# EAGLE design BackPlane (EAGLE 8.6.1)
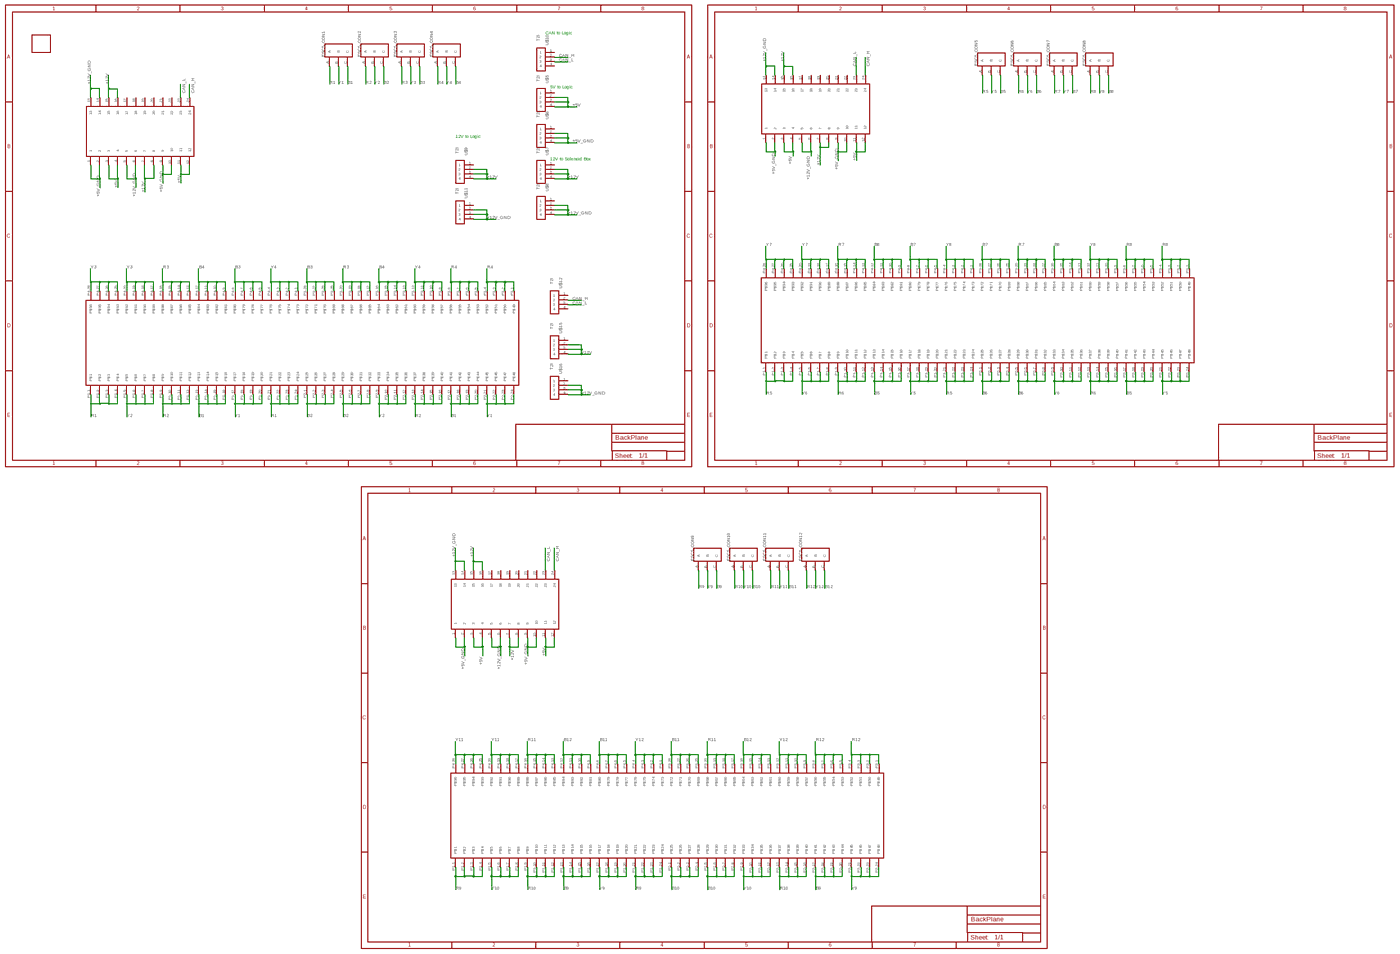
[diagram p0: schematic, sheet 1, overview]
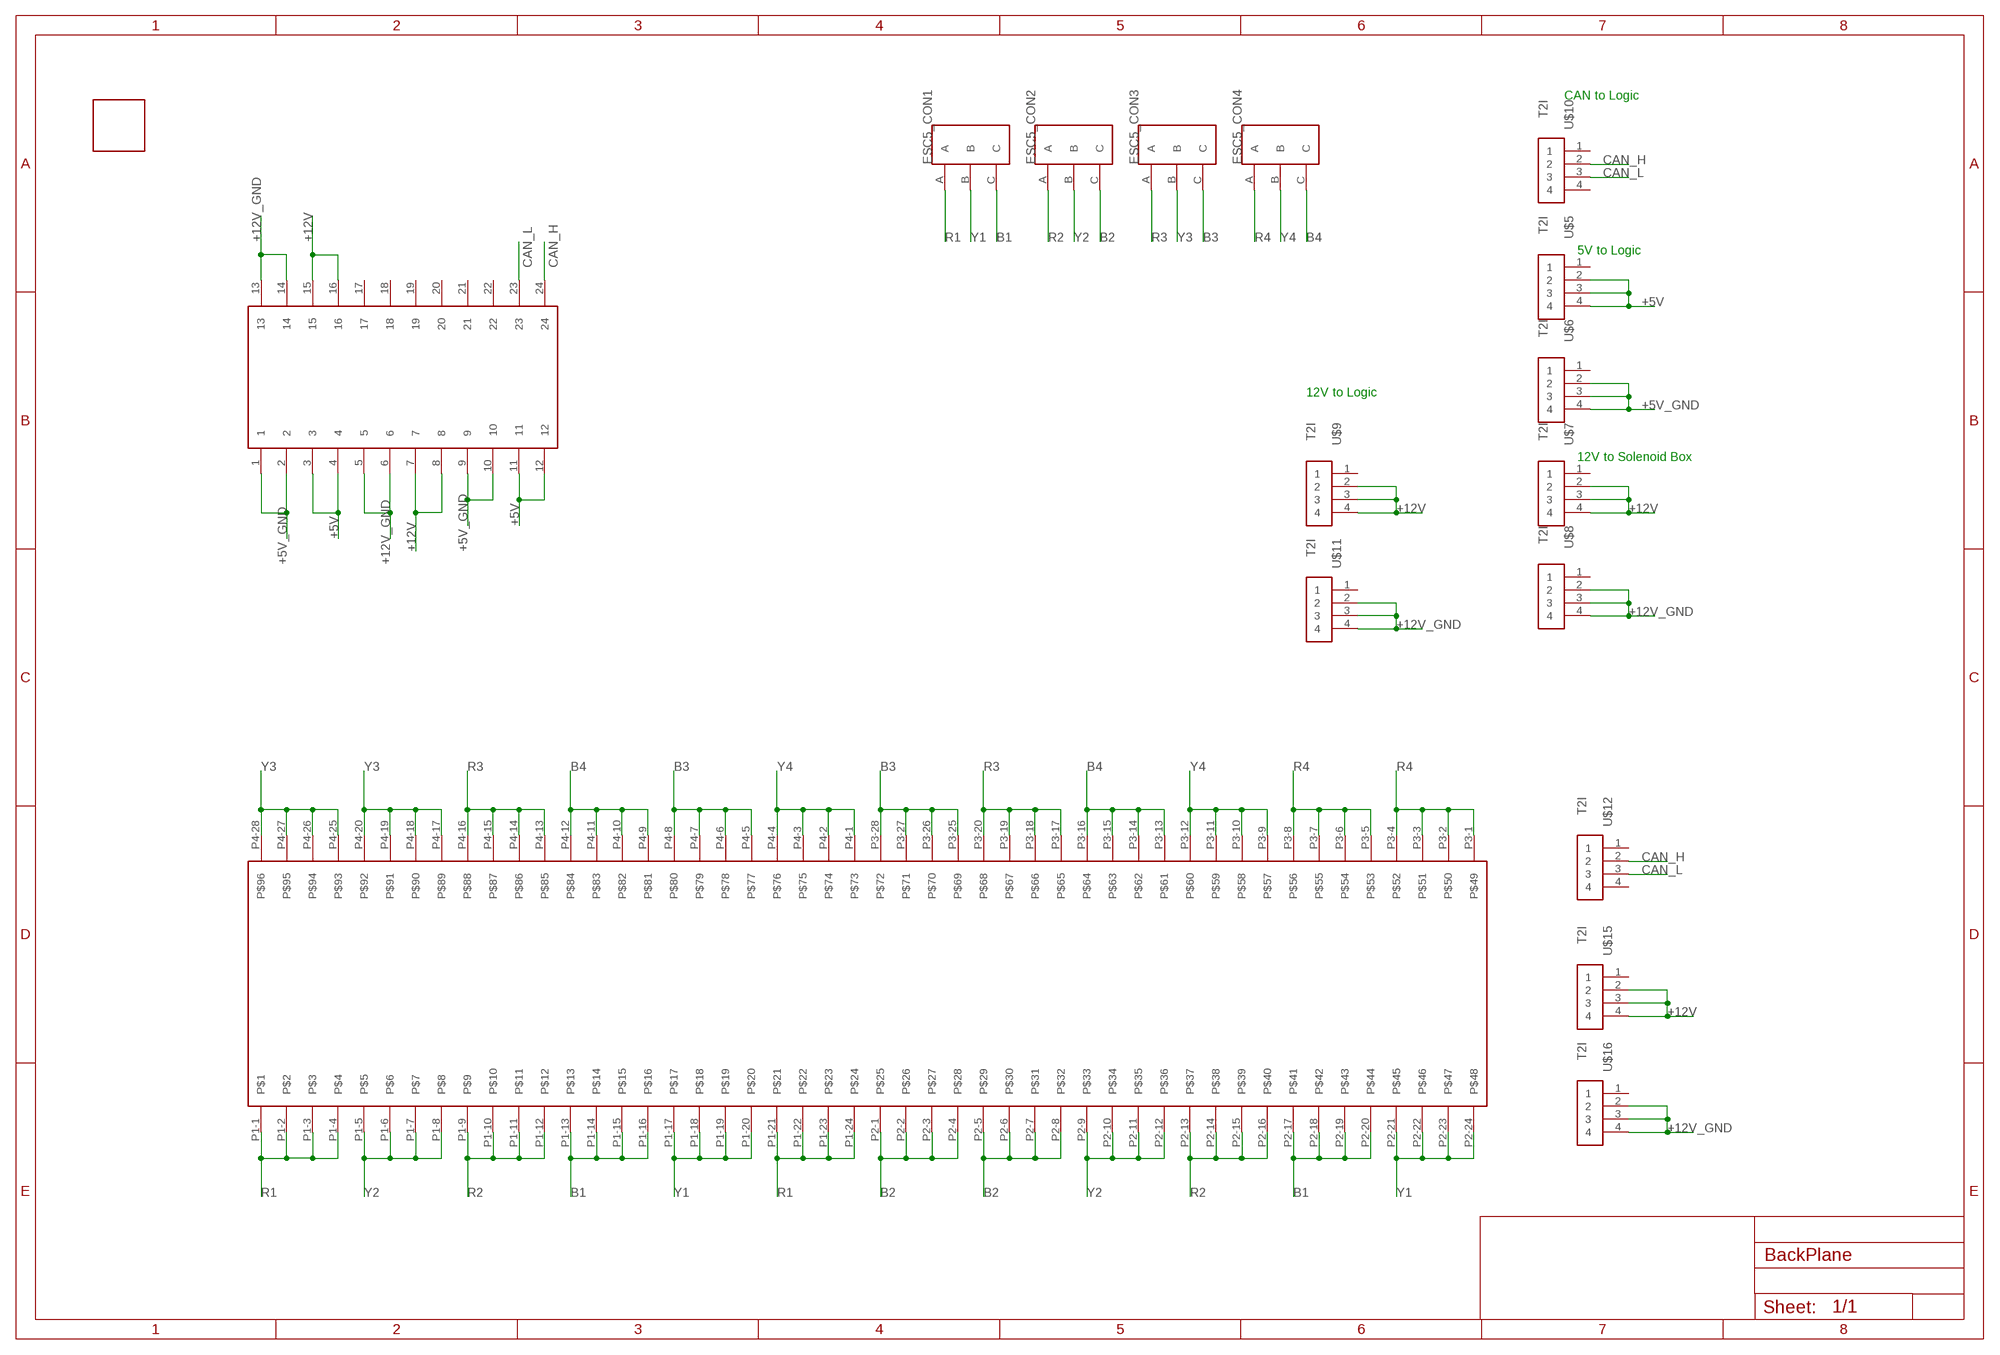
[diagram p1: schematic, sheet 1, part 1 of 4]
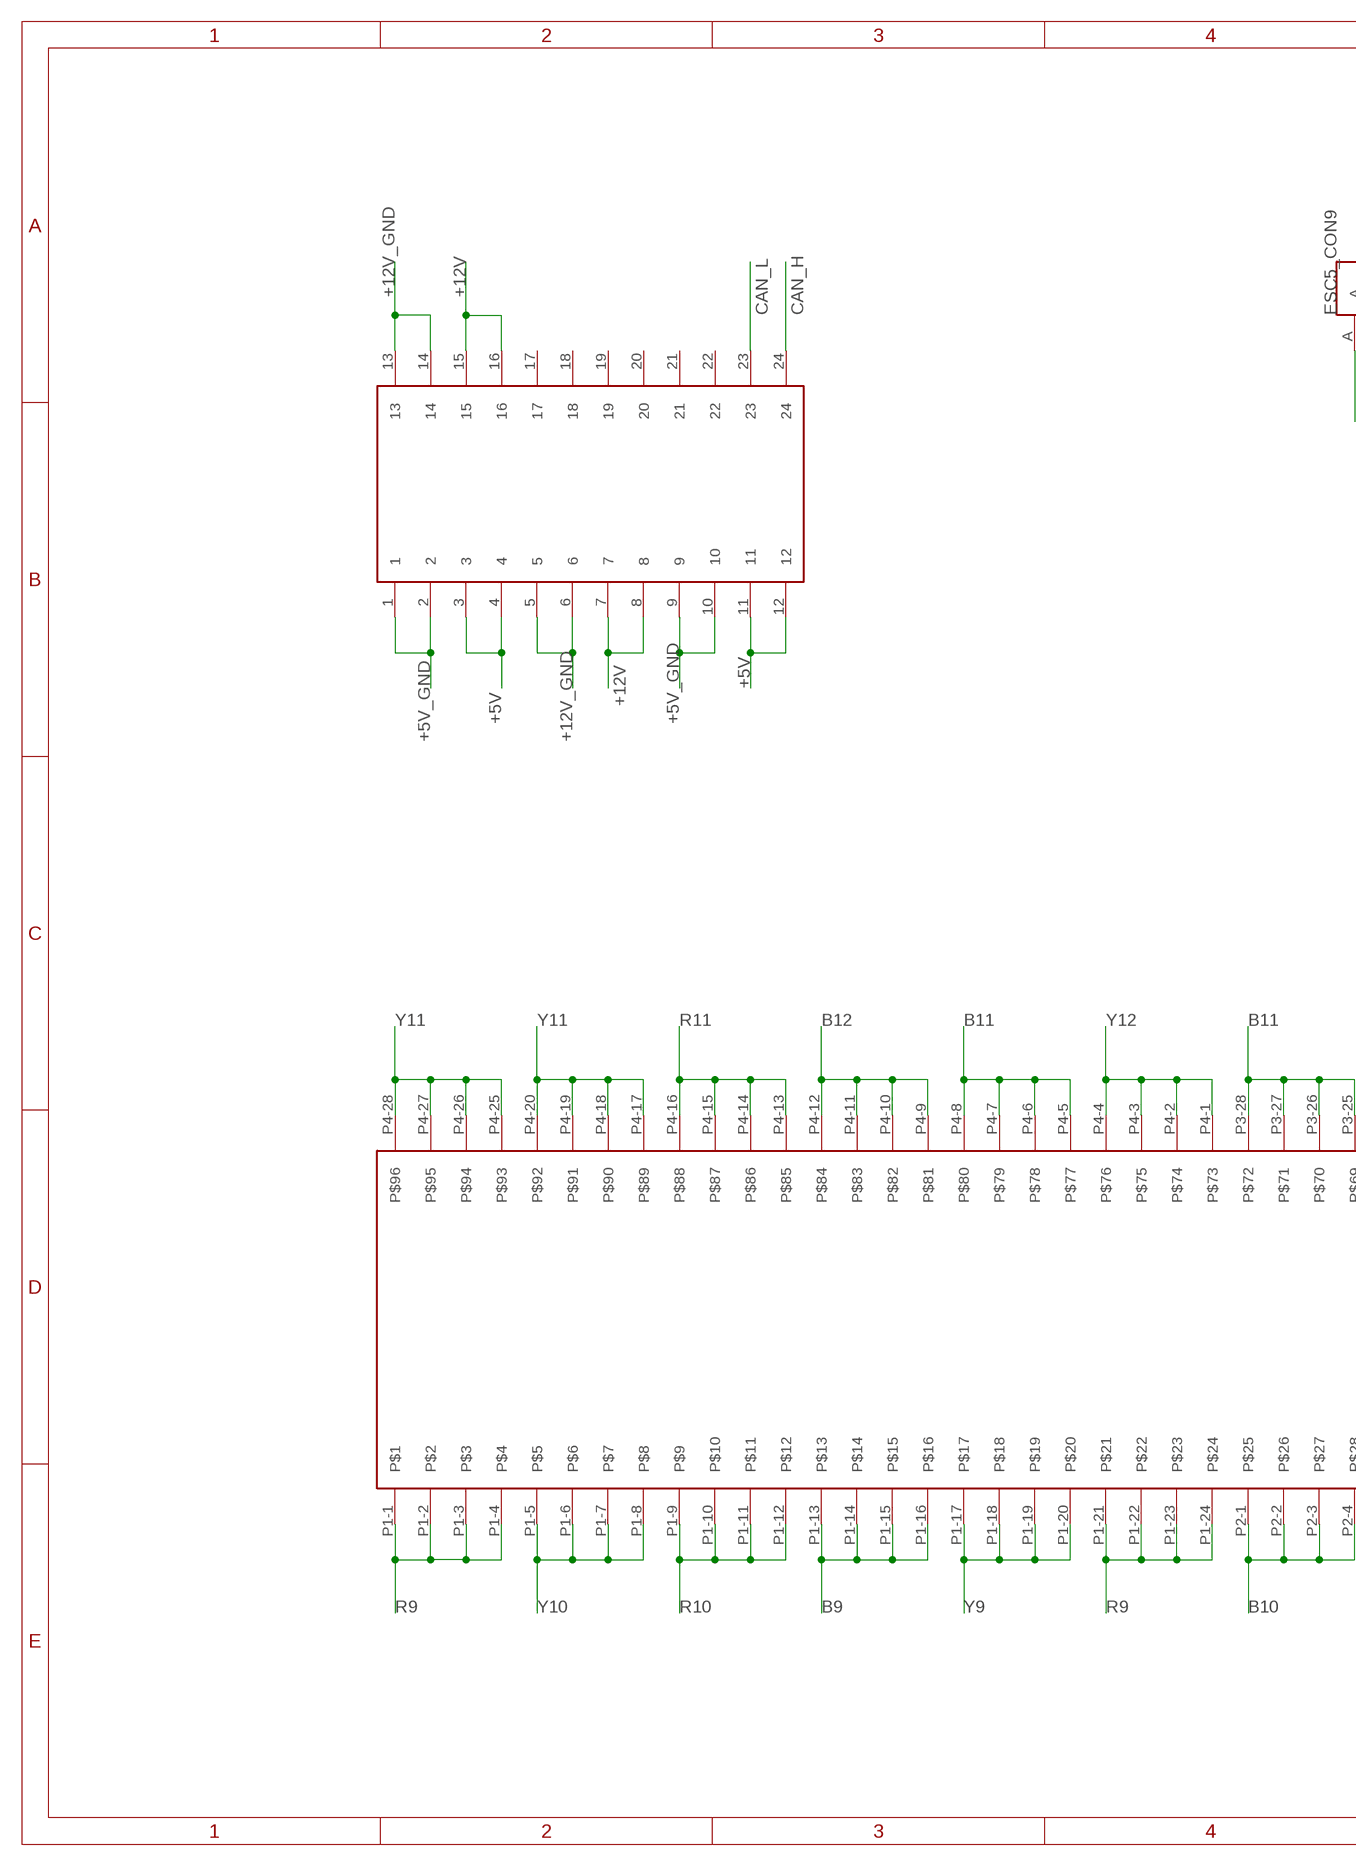
[diagram p2: schematic, sheet 1, part 2 of 4]
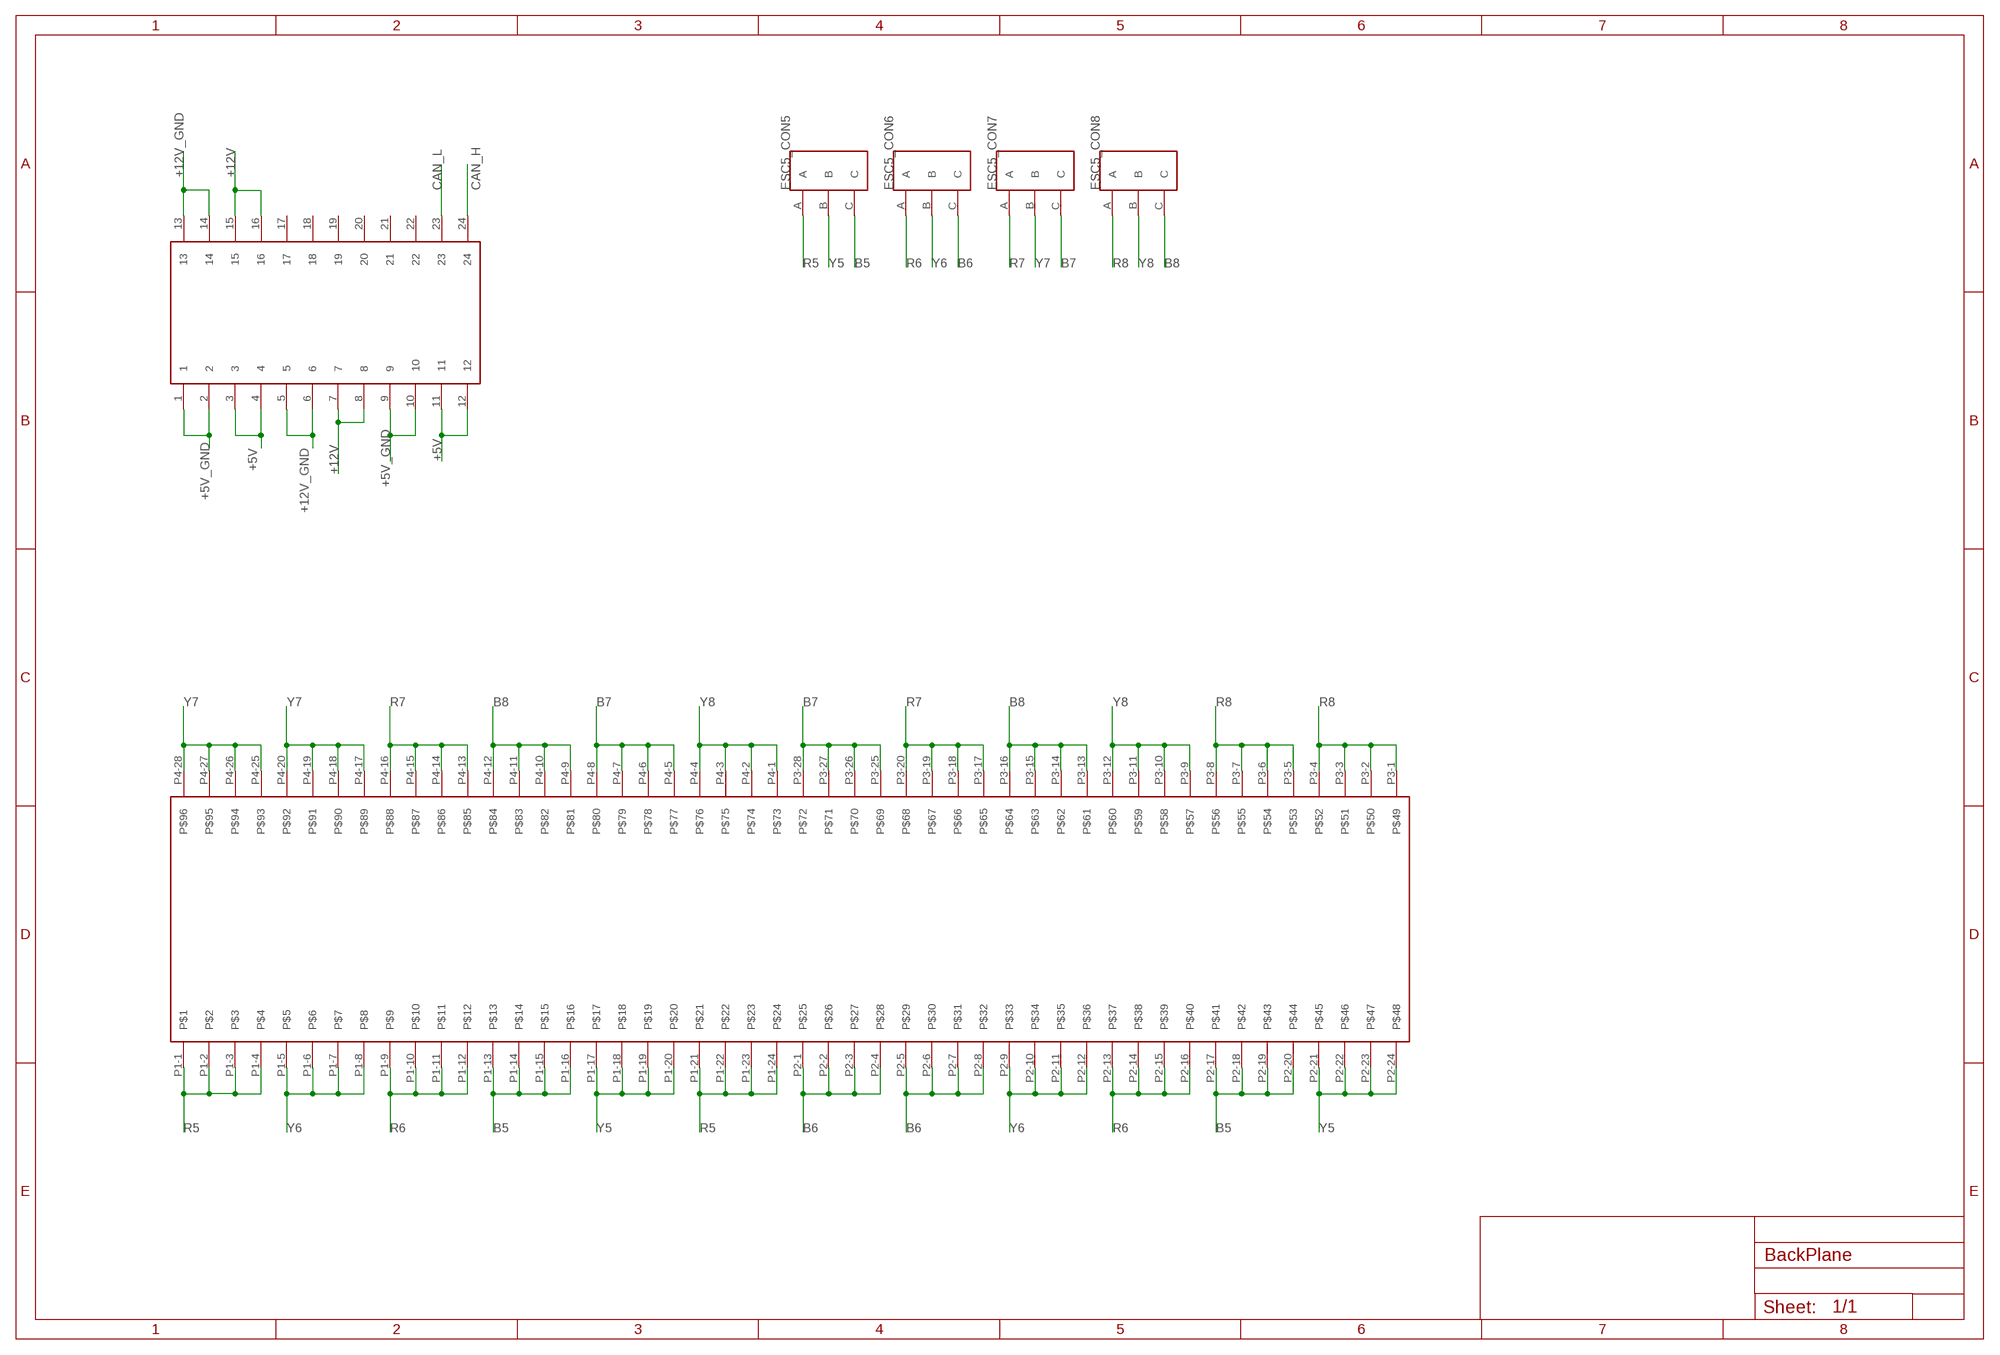
[diagram p3: schematic, sheet 1, part 3 of 4]
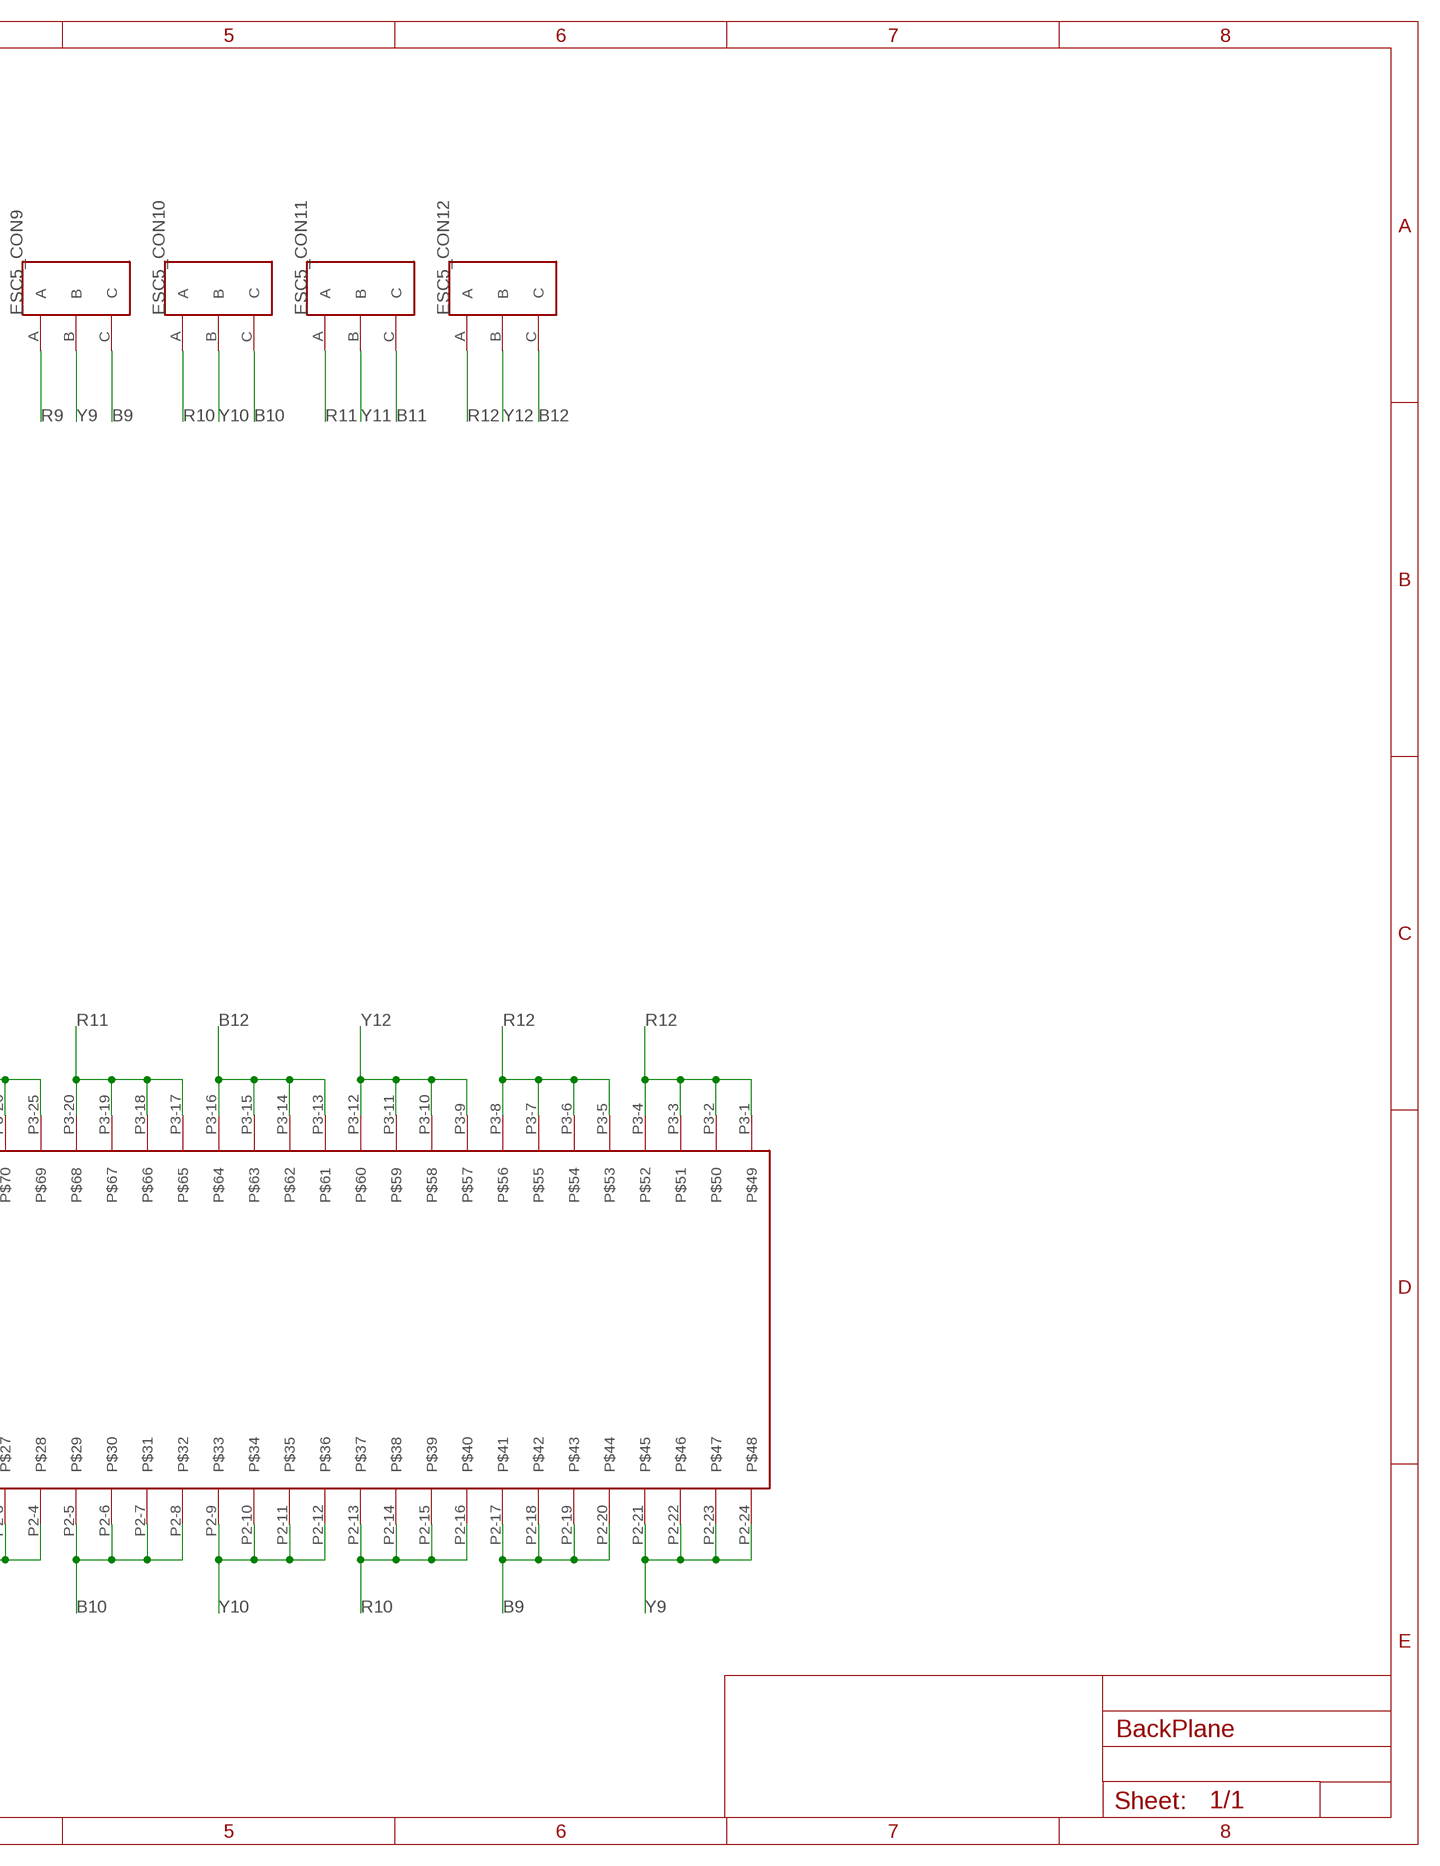
[diagram p4: schematic, sheet 1, part 4 of 4]

## Parts
ESC5_CON1  3PINCONNECTOR  [3PINCONNECTOR]
ESC5_CON2  3PINCONNECTOR  [3PINCONNECTOR]
ESC5_CON3  3PINCONNECTOR  [3PINCONNECTOR]
ESC5_CON4  3PINCONNECTOR  [3PINCONNECTOR]
ESC5_CON5  3PINCONNECTOR  [3PINCONNECTOR]
ESC5_CON6  3PINCONNECTOR  [3PINCONNECTOR]
ESC5_CON7  3PINCONNECTOR  [3PINCONNECTOR]
ESC5_CON8  3PINCONNECTOR  [3PINCONNECTOR]
ESC5_CON9  3PINCONNECTOR  [3PINCONNECTOR]
ESC5_CON10  3PINCONNECTOR  [3PINCONNECTOR]
ESC5_CON11  3PINCONNECTOR  [3PINCONNECTOR]
ESC5_CON12  3PINCONNECTOR  [3PINCONNECTOR]
U$1  BOARDBKP  [BKP]
U$2  THICC_CONNECTOR  [THICC_CONNECTOR]
U$3  THICC_CONNECTOR  [THICC_CONNECTOR]
U$4  THICC_CONNECTOR  [THICC_CONNECTOR]
U$5  T2I  [T2I]
U$6  T2I  [T2I]
U$7  T2I  [T2I]
U$8  T2I  [T2I]
U$9  T2I  [T2I]
U$10  T2I  [T2I]
U$11  T2I  [T2I]
U$12  T2I  [T2I]
U$15  T2I  [T2I]
U$16  T2I  [T2I]

## Nets
+5V: U$2.3 U$2.4 U$2.11 U$2.12 U$3.3 U$3.4 U$3.11 U$3.12 U$4.3 U$4.4 U$4.11 U$4.12 U$5.2 U$5.3 U$5.4
+5V_GND: U$2.1 U$2.2 U$2.9 U$2.10 U$3.1 U$3.2 U$3.9 U$3.10 U$4.1 U$4.2 U$4.9 U$4.10 U$6.2 U$6.3 U$6.4
+12V: U$2.7 U$2.8 U$2.15 U$2.16 U$3.7 U$3.8 U$3.15 U$3.16 U$4.7 U$4.8 U$4.15 U$4.16 U$7.2 U$7.3 U$7.4 U$9.2 U$9.3 U$9.4 U$15.2 U$15.3 U$15.4
+12V_GND: U$2.5 U$2.6 U$2.13 U$2.14 U$3.5 U$3.6 U$3.13 U$3.14 U$4.5 U$4.6 U$4.13 U$4.14 U$8.2 U$8.3 U$8.4 U$11.2 U$11.3 U$11.4 U$16.2 U$16.3 U$16.4
B1: ESC5_CON1.C U$2.P1-13 U$2.P1-14 U$2.P1-15 U$2.P1-16 U$2.P2-17 U$2.P2-18 U$2.P2-19 U$2.P2-20
B2: ESC5_CON2.C U$2.P2-1 U$2.P2-2 U$2.P2-3 U$2.P2-4 U$2.P2-5 U$2.P2-6 U$2.P2-7 U$2.P2-8
B3: ESC5_CON3.C U$2.P3-25 U$2.P3-26 U$2.P3-27 U$2.P3-28 U$2.P4-5 U$2.P4-6 U$2.P4-7 U$2.P4-8
B4: ESC5_CON4.C U$2.P3-13 U$2.P3-14 U$2.P3-15 U$2.P3-16 U$2.P4-9 U$2.P4-10 U$2.P4-11 U$2.P4-12
B5: ESC5_CON5.C U$3.P1-13 U$3.P1-14 U$3.P1-15 U$3.P1-16 U$3.P2-17 U$3.P2-18 U$3.P2-19 U$3.P2-20
B6: ESC5_CON6.C U$3.P2-1 U$3.P2-2 U$3.P2-3 U$3.P2-4 U$3.P2-5 U$3.P2-6 U$3.P2-7 U$3.P2-8
B7: ESC5_CON7.C U$3.P3-25 U$3.P3-26 U$3.P3-27 U$3.P3-28 U$3.P4-5 U$3.P4-6 U$3.P4-7 U$3.P4-8
B8: ESC5_CON8.C U$3.P3-13 U$3.P3-14 U$3.P3-15 U$3.P3-16 U$3.P4-9 U$3.P4-10 U$3.P4-11 U$3.P4-12
B9: ESC5_CON9.C U$4.P1-13 U$4.P1-14 U$4.P1-15 U$4.P1-16 U$4.P2-17 U$4.P2-18 U$4.P2-19 U$4.P2-20
B10: ESC5_CON10.C U$4.P2-1 U$4.P2-2 U$4.P2-3 U$4.P2-4 U$4.P2-5 U$4.P2-6 U$4.P2-7 U$4.P2-8
B11: ESC5_CON11.C U$4.P3-25 U$4.P3-26 U$4.P3-27 U$4.P3-28 U$4.P4-5 U$4.P4-6 U$4.P4-7 U$4.P4-8
B12: ESC5_CON12.C U$4.P3-13 U$4.P3-14 U$4.P3-15 U$4.P3-16 U$4.P4-9 U$4.P4-10 U$4.P4-11 U$4.P4-12
CAN_H: U$2.24 U$3.24 U$4.24 U$10.2 U$12.2
CAN_L: U$2.23 U$3.23 U$4.23 U$10.3 U$12.3
R1: ESC5_CON1.A U$2.P1-1 U$2.P1-2 U$2.P1-3 U$2.P1-4 U$2.P1-21 U$2.P1-22 U$2.P1-23 U$2.P1-24
R2: ESC5_CON2.A U$2.P1-9 U$2.P1-10 U$2.P1-11 U$2.P1-12 U$2.P2-13 U$2.P2-14 U$2.P2-15 U$2.P2-16
R3: ESC5_CON3.A U$2.P3-17 U$2.P3-18 U$2.P3-19 U$2.P3-20 U$2.P4-13 U$2.P4-14 U$2.P4-15 U$2.P4-16
R4: ESC5_CON4.A U$2.P3-1 U$2.P3-2 U$2.P3-3 U$2.P3-4 U$2.P3-5 U$2.P3-6 U$2.P3-7 U$2.P3-8
R5: ESC5_CON5.A U$3.P1-1 U$3.P1-2 U$3.P1-3 U$3.P1-4 U$3.P1-21 U$3.P1-22 U$3.P1-23 U$3.P1-24
R6: ESC5_CON6.A U$3.P1-9 U$3.P1-10 U$3.P1-11 U$3.P1-12 U$3.P2-13 U$3.P2-14 U$3.P2-15 U$3.P2-16
R7: ESC5_CON7.A U$3.P3-17 U$3.P3-18 U$3.P3-19 U$3.P3-20 U$3.P4-13 U$3.P4-14 U$3.P4-15 U$3.P4-16
R8: ESC5_CON8.A U$3.P3-1 U$3.P3-2 U$3.P3-3 U$3.P3-4 U$3.P3-5 U$3.P3-6 U$3.P3-7 U$3.P3-8
R9: ESC5_CON9.A U$4.P1-1 U$4.P1-2 U$4.P1-3 U$4.P1-4 U$4.P1-21 U$4.P1-22 U$4.P1-23 U$4.P1-24
R10: ESC5_CON10.A U$4.P1-9 U$4.P1-10 U$4.P1-11 U$4.P1-12 U$4.P2-13 U$4.P2-14 U$4.P2-15 U$4.P2-16
R11: ESC5_CON11.A U$4.P3-17 U$4.P3-18 U$4.P3-19 U$4.P3-20 U$4.P4-13 U$4.P4-14 U$4.P4-15 U$4.P4-16
R12: ESC5_CON12.A U$4.P3-1 U$4.P3-2 U$4.P3-3 U$4.P3-4 U$4.P3-5 U$4.P3-6 U$4.P3-7 U$4.P3-8
Y1: ESC5_CON1.B U$2.P1-17 U$2.P1-18 U$2.P1-19 U$2.P1-20 U$2.P2-21 U$2.P2-22 U$2.P2-23 U$2.P2-24
Y2: ESC5_CON2.B U$2.P1-5 U$2.P1-6 U$2.P1-7 U$2.P1-8 U$2.P2-9 U$2.P2-10 U$2.P2-11 U$2.P2-12
Y3: ESC5_CON3.B U$2.P4-17 U$2.P4-18 U$2.P4-19 U$2.P4-20 U$2.P4-25 U$2.P4-26 U$2.P4-27 U$2.P4-28
Y4: ESC5_CON4.B U$2.P3-9 U$2.P3-10 U$2.P3-11 U$2.P3-12 U$2.P4-1 U$2.P4-2 U$2.P4-3 U$2.P4-4
Y5: ESC5_CON5.B U$3.P1-17 U$3.P1-18 U$3.P1-19 U$3.P1-20 U$3.P2-21 U$3.P2-22 U$3.P2-23 U$3.P2-24
Y6: ESC5_CON6.B U$3.P1-5 U$3.P1-6 U$3.P1-7 U$3.P1-8 U$3.P2-9 U$3.P2-10 U$3.P2-11 U$3.P2-12
Y7: ESC5_CON7.B U$3.P4-17 U$3.P4-18 U$3.P4-19 U$3.P4-20 U$3.P4-25 U$3.P4-26 U$3.P4-27 U$3.P4-28
Y8: ESC5_CON8.B U$3.P3-9 U$3.P3-10 U$3.P3-11 U$3.P3-12 U$3.P4-1 U$3.P4-2 U$3.P4-3 U$3.P4-4
Y9: ESC5_CON9.B U$4.P1-17 U$4.P1-18 U$4.P1-19 U$4.P1-20 U$4.P2-21 U$4.P2-22 U$4.P2-23 U$4.P2-24
Y10: ESC5_CON10.B U$4.P1-5 U$4.P1-6 U$4.P1-7 U$4.P1-8 U$4.P2-9 U$4.P2-10 U$4.P2-11 U$4.P2-12
Y11: ESC5_CON11.B U$4.P4-17 U$4.P4-18 U$4.P4-19 U$4.P4-20 U$4.P4-25 U$4.P4-26 U$4.P4-27 U$4.P4-28
Y12: ESC5_CON12.B U$4.P3-9 U$4.P3-10 U$4.P3-11 U$4.P3-12 U$4.P4-1 U$4.P4-2 U$4.P4-3 U$4.P4-4
Unconnected: U$2.17 U$2.18 U$2.19 U$2.20 U$2.21 U$2.22 U$3.17 U$3.18 U$3.19 U$3.20 U$3.21 U$3.22 U$4.17 U$4.18 U$4.19 U$4.20 U$4.21 U$4.22 U$5.1 U$6.1 U$7.1 U$8.1 U$9.1 U$10.1 U$10.4 U$11.1 U$12.1 U$12.4 U$15.1 U$16.1

## Notes on the sheet
- CAN to Logic
- 5V to Logic
- 12V to Logic
- 12V to Solenoid Box

## Library data of the parts
ESC5_CON1-ESC5_CON12 = afro_20A_esc:3PINCONNECTOR
U$1 = board_outlines:BOARD
U$2-U$4 = THICC_CONNECTOR:THICC_CONNECTOR
U$5-U$12 U$15 U$16 = BackplaneParts:T2I

## Board
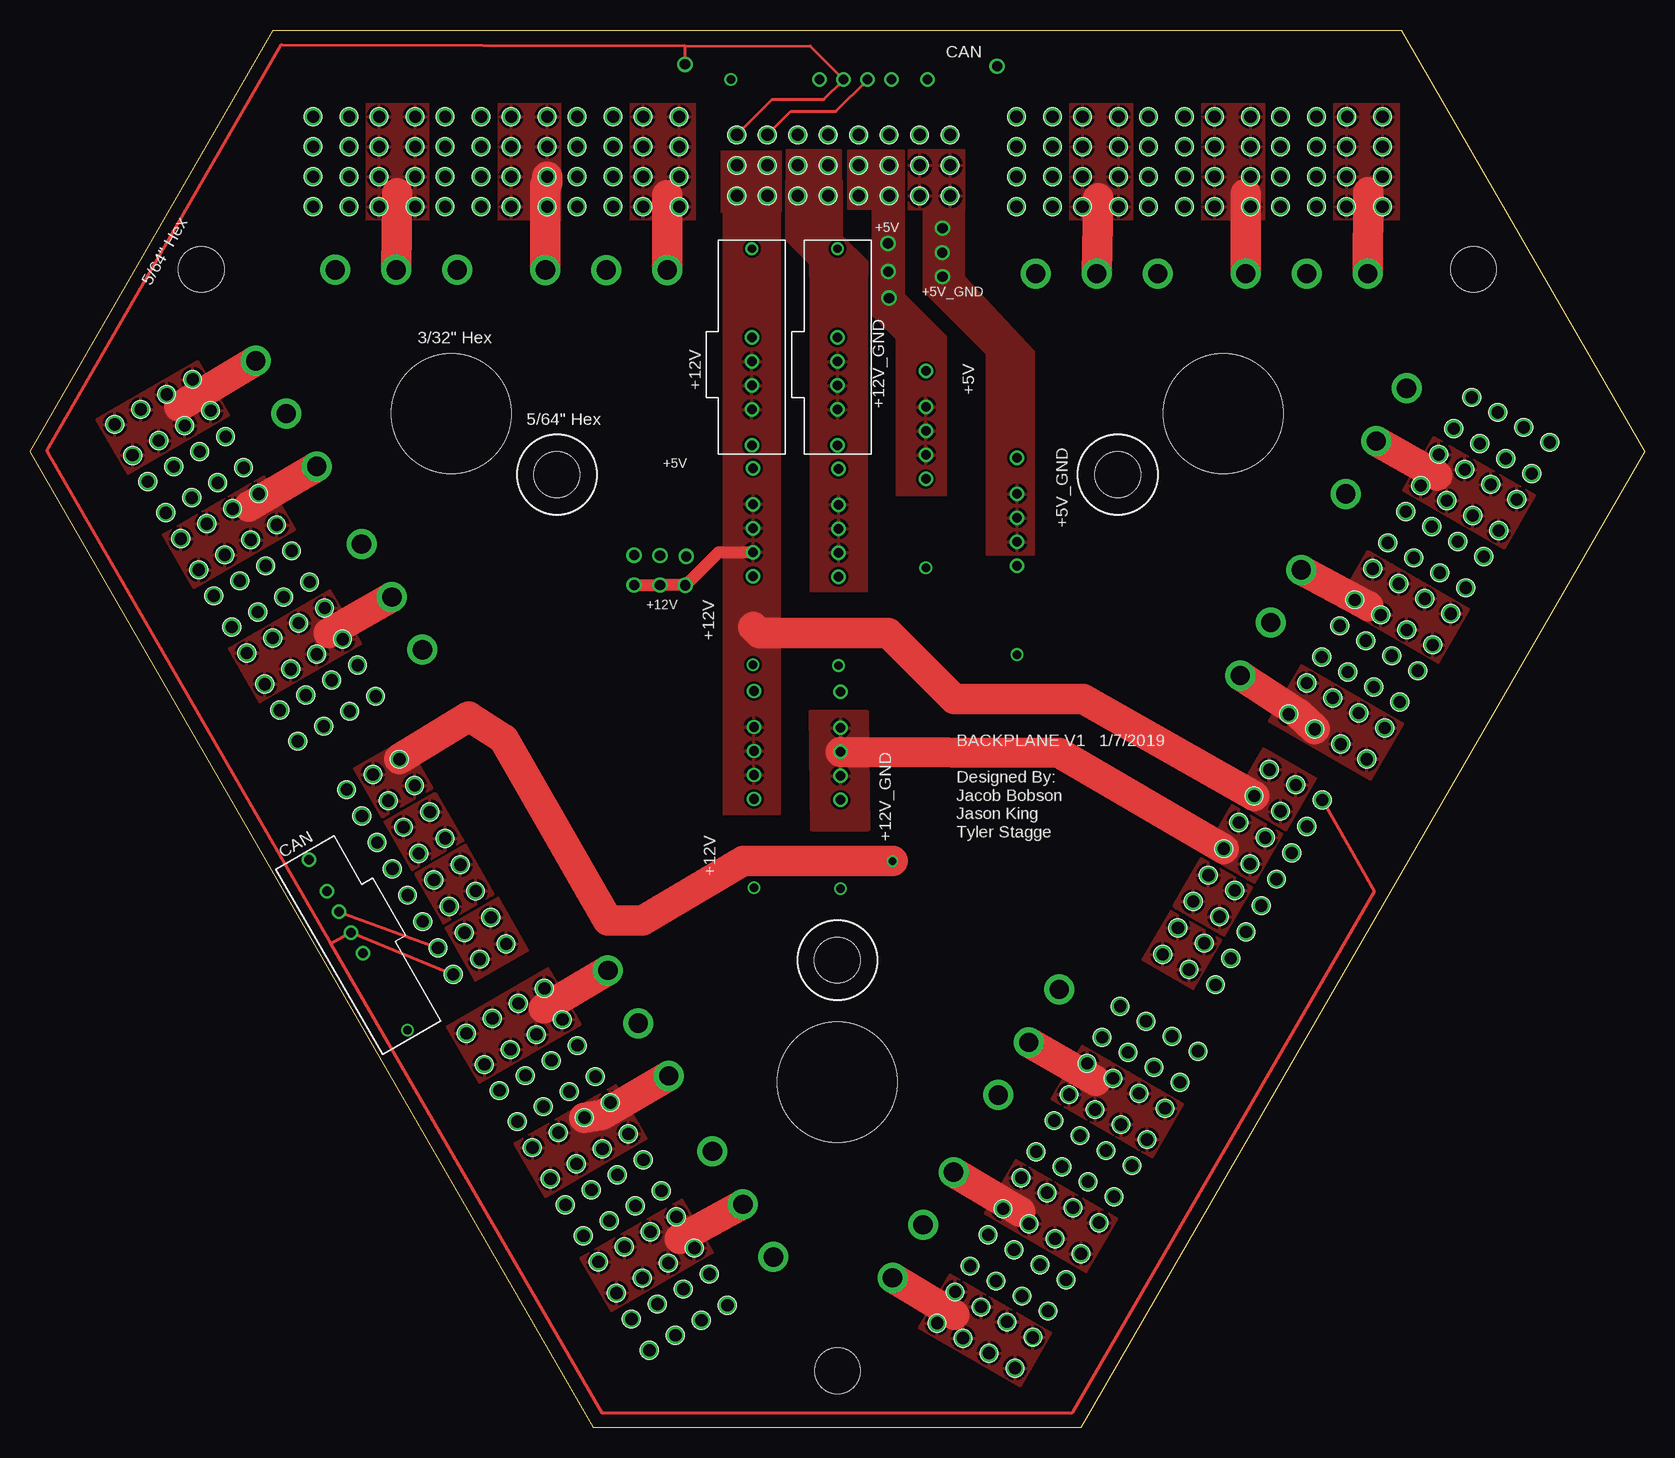
[diagram p5: board, top side]
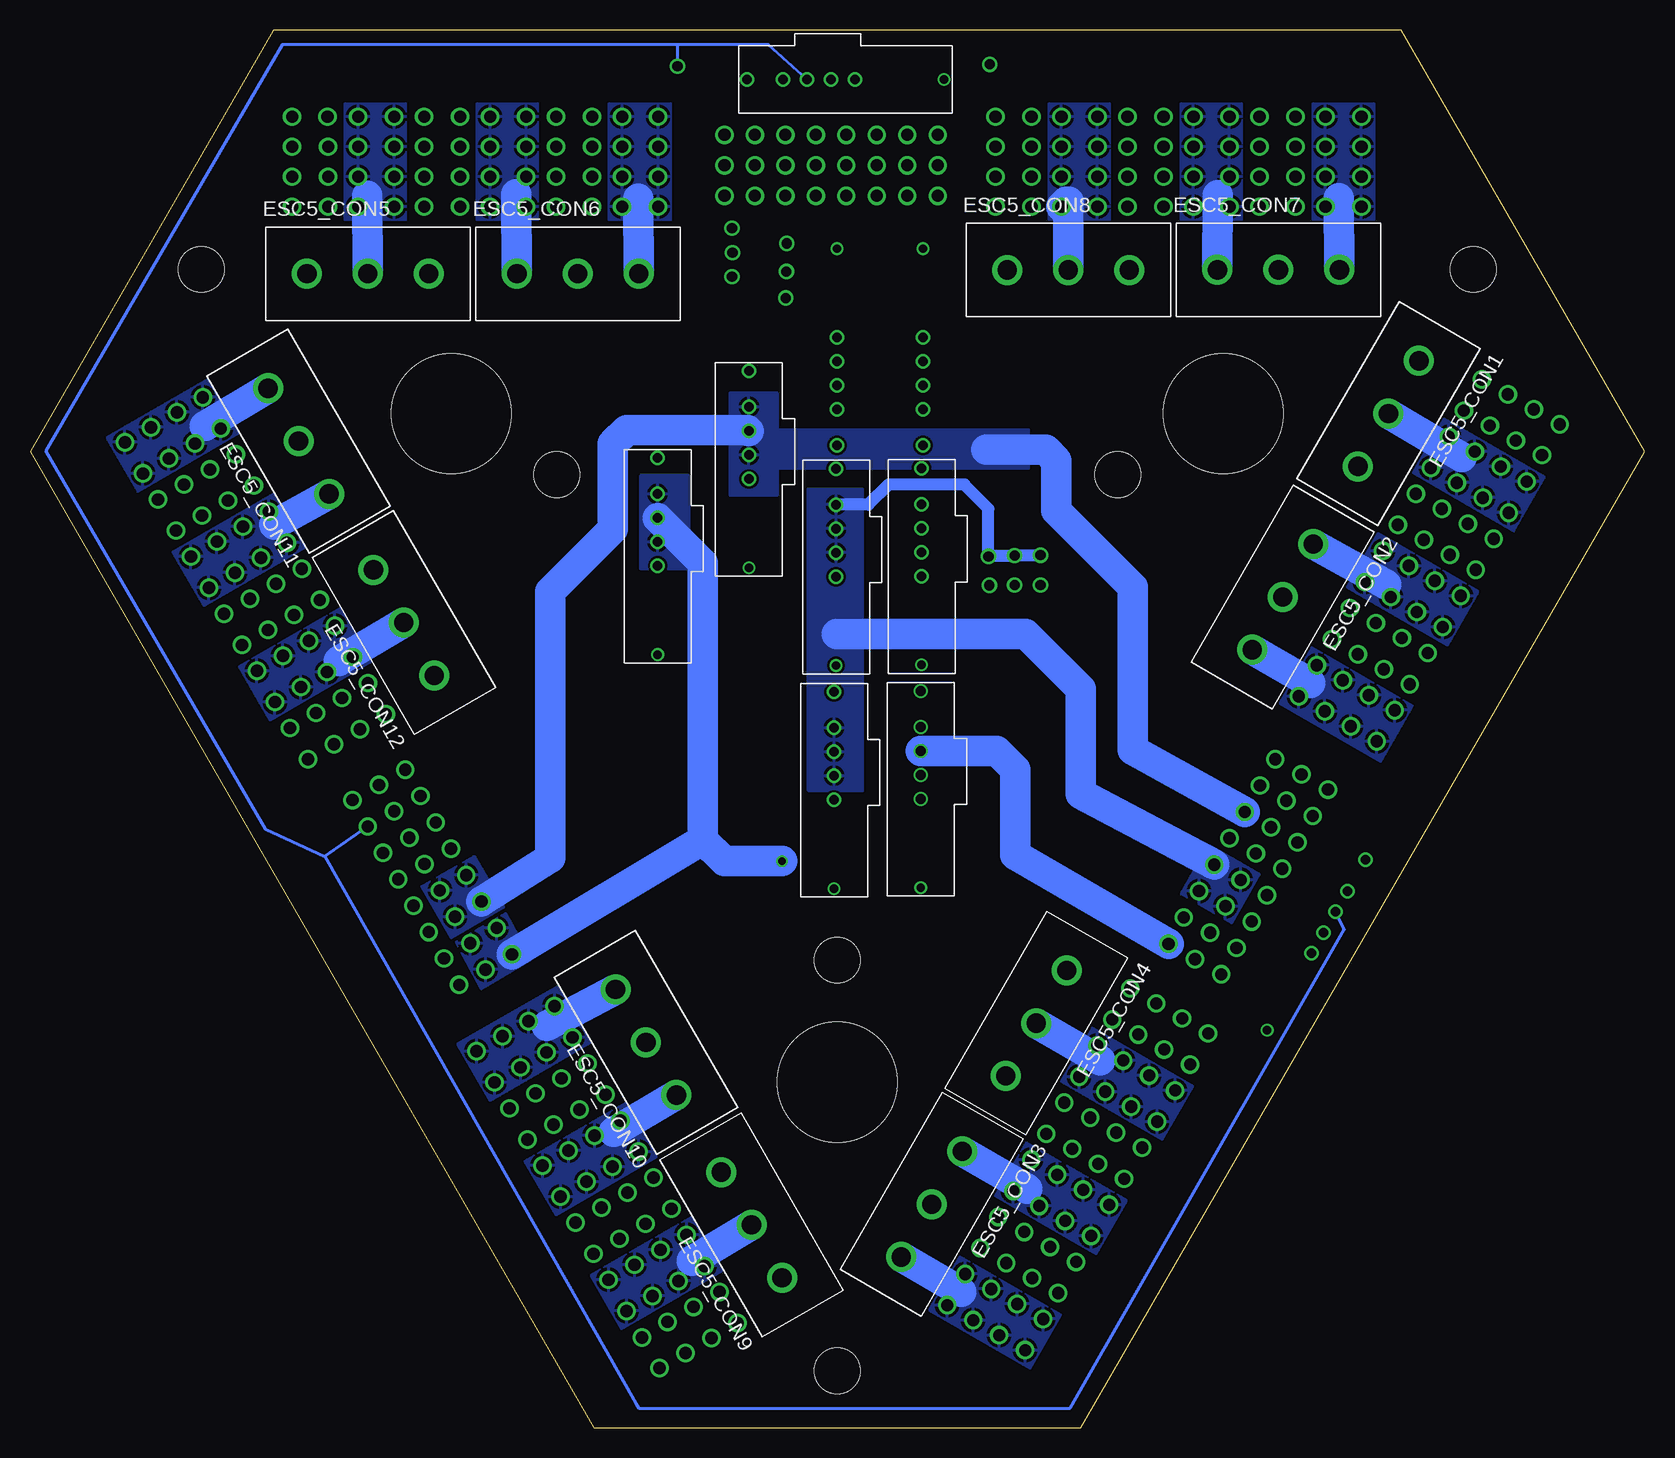
[diagram p6: board, bottom side, seen from below]

Size 134.56 x 116.53 mm. Coordinates in mm from the lower left corner, seen from the top.
Copper layers (1*16): Top 0.0356mm / dielectric 1.5011mm / Bottom 0.0356mm
Design rules "ECE_Senior_Design": minimum track width 8mil, minimum drill 13mil, track to track 8mil, track to pad 8mil, pad to pad 6mil, via to via 8mil, smd to smd 6mil, copper to edge 15mil, drill to drill 8mil, minimum pad ring 7mil, minimum via ring 7mil, stop-mask expansion 3mil, vias tented up to drill 0mil, thermal gap 10mil
Holes 10 mm at 35.11,84.55 99.45,84.55 67.28,28.82
Holes 3.8 mm at 43.91,79.47 90.65,79.47 67.28,38.98

### Footprints (pad centres in the part's own frame; a part is rotated, then mirrored left to right if it is on the bottom)
3PINCONNECTOR = drill 1.6 pad 2.5: A -5.08,0; B 0,0; C 5.08,0
BKP = hole 3.797: 14.275,96.571; 120.294,96.571; 67.285,4.75
THICC_CONNECTOR = drill 1.02 pad 1.22: 1 11.89,7.26; 2 9.35,7.26; 3 6.81,7.26; 4 4.27,7.26; 5 1.73,7.26; 6 -0.81,7.26; 7 -3.35,7.26; 8 -5.89,7.26; 9 11.89,9.8; 10 9.35,9.8; 11 6.81,9.8; 12 4.27,9.8; 13 1.73,9.8; 14 -0.81,9.8; 15 -3.35,9.8; 16 -5.89,9.8; 17 11.89,12.34; 18 9.35,12.34; 19 6.81,12.34; 20 4.27,12.34; 21 1.73,12.34; 22 -0.81,12.34; 23 -3.35,12.34; 24 -5.89,12.34; P1-1 47.91,6.35; P1-2 47.91,8.85; P1-3 47.91,11.35; P1-4 47.91,13.85; P1-5 22.91,6.35; P1-6 22.91,8.85; P1-7 22.91,11.35; P1-8 22.91,13.85; P1-9 28.41,6.35; P1-10 28.41,8.85; P1-11 28.41,11.35; P1-12 28.41,13.85; P1-13 33.91,6.35; P1-14 33.91,8.85; P1-15 33.91,11.35; P1-16 33.91,13.85; P1-17 39.41,6.35; P1-18 39.41,8.85; P1-19 39.41,11.35; P1-20 39.41,13.85; P1-21 44.91,6.35; P1-22 44.91,8.85; P1-23 44.91,11.35; P1-24 44.96,13.85; P2-1 20.41,6.35; P2-2 20.41,8.85; P2-3 20.41,11.35; P2-4 20.41,13.85; P2-5 17.41,6.35; P2-6 17.41,8.85; P2-7 17.41,11.35; P2-8 17.41,13.85; P2-9 25.91,6.35; P2-10 25.91,8.85; P2-11 25.91,11.35; P2-12 25.91,13.85; P2-13 31.41,6.35; P2-14 31.41,8.85; P2-15 31.41,11.35; P2-16 31.41,13.85; P2-17 36.91,6.35; P2-18 36.91,8.85; P2-19 36.91,11.35; P2-20 36.91,13.85; P2-21 42.41,6.35; P2-22 42.41,8.85; P2-23 42.41,11.35; P2-24 42.41,13.85; P3-1 -10.7,6.35; P3-2 -10.7,8.85; P3-3 -10.7,11.35; P3-4 -10.7,13.85; P3-5 -13.7,6.35; P3-6 -13.7,8.85; P3-7 -13.7,11.35; P3-8 -13.7,13.85; P3-9 -19.2,6.35; P3-10 -19.2,8.85; P3-11 -19.2,11.35; P3-12 -19.2,13.85; P3-13 -24.7,6.35; P3-14 -24.7,8.85; P3-15 -24.7,11.35; P3-16 -24.7,13.85; P3-17 -30.2,6.35; P3-18 -30.2,8.85; P3-19 -30.2,11.35; P3-20 -30.2,13.85; P3-25 -38.2,6.35; P3-26 -38.2,8.85; P3-27 -38.2,11.35; P3-28 -38.2,13.85; P4-1 -16.2,6.35; P4-2 -16.2,8.85; P4-3 -16.2,11.35; P4-4 -16.2,13.85; P4-5 -41.2,6.35; P4-6 -41.2,8.85; P4-7 -41.2,11.35; P4-8 -41.2,13.85; P4-9 -21.7,6.35; P4-10 -21.7,8.85; P4-11 -21.7,11.35; P4-12 -21.7,13.85; P4-13 -27.2,6.35; P4-14 -27.2,8.85; P4-15 -27.2,11.35; P4-16 -27.2,13.85; P4-17 -32.7,6.35; P4-18 -32.7,8.85; P4-19 -32.7,11.35; P4-20 -32.7,13.85; P4-25 -35.7,6.35; P4-26 -35.7,8.85; P4-27 -35.7,11.35; P4-28 -35.7,13.85
T2I = drill 0.8: 1 8.1,2.8; 2 10.1,2.8; 3 12.1,2.8; 4 14.1,2.8; S2 17.1,2.8 | drill 0.7: S1 0.7,2.8

### Placement (x,y rotation side)
ESC5_CON1  21.35,84.55 240 bottom
ESC5_CON2  30.17,69.26 240 bottom
ESC5_CON3  59.41,18.64 240 bottom
ESC5_CON4  50.7,33.73 240 bottom
ESC5_CON5  106.4,96.21 0 bottom
ESC5_CON6  88.9,96.21 0 bottom
ESC5_CON7  30.52,96.53 0 bottom
ESC5_CON8  48.03,96.52 0 bottom
ESC5_CON9  74.42,16.91 120 bottom
ESC5_CON10  83.22,32.14 120 bottom
ESC5_CON11  112.18,82.26 120 bottom
ESC5_CON12  103.4,67.13 120 bottom
U$1  0,0 0 top
U$2  43.02,49.08 120 top
U$3  64.8,95.45 0 top
U$4  94.05,53.4 240 top
U$5  71.85,71 90 bottom
U$6  79.45,63.76 90 bottom
U$7  57.45,62.9 90 bottom
U$8  64.58,62.85 90 bottom
U$9  57.52,44.33 90 bottom
U$10  57.7,115.2 180 bottom
U$11  64.75,44.25 90 bottom
U$12  34.23,33.94 120 top
U$15  57.35,99 270 top
U$16  64.5,99 270 top

### Tracks (layer width: path | path; a pad name or v marks a point on that pad's centre or on a via)
+5V  (via drill 0.85)
  Bottom 2.54: U$4.3 91.19,47.5 91.19,69.72 85.98,74.93 85.98,82.04 84.84,83.19 74.73,83.19 U$5.3 | U$2.3 42.67,56.52 42.67,70.1 49.02,76.45 49.02,80.64 49.91,81.53 54.86,81.53
  other vias: 71.5,98.73 71.58,94.18 71.53,96.39
  pour Top (no thermals): 68.18,106.5 72.8,106.5 72.8,101.7 72.7,101.6 68.18,101.6
  pour Top: 31.87,46.47 29.52,50.54 33.67,52.94 33.81,52.9 36.11,48.92
  pour Top: 101.84,45.07 99.49,41 95.33,43.4 95.3,43.54 97.6,47.52
  pour Top: 72.75,101.75 72.75,94.5 76.25,91 76.25,77.75 72.25,77.75 72.25,90.75 70.25,92.75 70.25,101.75
  pour Bottom: 72.25,86.25 76.25,86.25 76.25,77.76 72.25,77.76
  pour Bottom: 101.95,45.14 97.54,47.69 95.04,43.36 99.45,40.81
  pour Bottom: 76.2,80.01 51.31,80.01 51.31,83.19 76.2,83.19
+5V_GND  (via drill 0.6, 0.85)
  Top 2.54: v71.88,47.24 59.44,47.24 51.05,42.29 48.13,42.29 39.5,57.4 36.58,59.31 U$2.1
  Bottom 2.54: U$4.1 78.49,49.02 | 78.49,49.02 78.49,72.1 U$6.3 | 78.49,49.02 76.71,47.24 v71.88,47.24
  other vias: 76.05,95.96 76.02,97.97 76.05,100
  pour Top: 73.2,106.5 73.2,101.6 77.9,101.6 77.9,106.5
  pour Top: 29.32,50.88 33.56,53.33 31.21,57.4 26.97,54.95
  pour Top: 99.29,40.66 95.05,43.11 92.7,39.03 96.94,36.58
  pour Top: 77.75,101.75 77.75,96 83.62,89.75 83.62,72.8 79.75,72.8 79.75,89.5 74.5,94.75 74.5,101.75
  pour Bottom: 99.08,40.52 94.91,42.94 92.79,38.99 96.96,36.57
  pour Bottom: 79.63,79.38 83.69,79.38 83.69,71.63 79.63,71.63
+12V  (via drill 0.85)
  Top 1.016: v50.34,70.26 v52.5,70.26 54.59,70.26 v54.61,70.23 57.38,73 U$7.2
  Top 2.54: U$4.7 87.75,60.75 77,60.75 71.5,66.25 60.75,66.25 60.25,66.75
  Bottom 2.54: U$2.8 52.45,47.75 52.45,54.86 54.01,56.43 U$9.3
  pour Top (no thermals): 57.6,106.4 57.6,101.4 62.6,101.4 62.6,106.4
  pour Top: 37.08,37.24 41.5,39.79 39,44.22 34.58,41.67
  pour Top: 107.2,54.14 102.79,56.69 100.29,52.36 104.7,49.81
  pour Top: 57.75,101.5 57.75,51.19 62.5,51.19 62.5,101.5
+12V_GND  (via drill 0.85)
  Top 2.54: U$4.5 85.75,56.25 U$11.3
  Bottom 1.016: v50.34,72.75 50.37,72.72 v52.5,72.72 54.61,72.72 v54.69,72.64 54.69,76.63 56.69,78.64 62.99,78.64 64.68,76.95 U$8.4
  Bottom 2.54: U$2.5 46.99,52.83 46.99,61.59 51.56,66.17 67.31,66.17
  pour Top (no thermals): 63,101.6 67.6,101.6 67.6,106.5 63,106.5
  pour Top: 38.66,44.5 36.31,48.62 32.07,46.17 34.42,42.05
  pour Top: 100.15,51.94 97.8,47.87 102.04,45.42 104.39,49.49
  pour Top: 65,97.25 65,69.75 69.75,69.75 69.75,97.25
  pour Top (no thermals): 63,104 67.65,104 67.65,99.35 69.75,97.25 69.75,96 65,96 65,97 63,99
  pour Bottom: 38.66,44.5 36.31,48.62 32.07,46.17 34.42,42.05
  pour Bottom: 65.1,78.25 69.8,78.25 69.8,53.2 69.7,53.1 65.1,53.1
  pour Top: 65,59.75 69.75,59.75 69.88,49.82 65.13,49.82
B1
  Top 2.54: ESC5_CON1.C 18.25,76.79
  pour Top: 19.5,79.36 22.1,74.86 13.66,69.99 11.06,74.48
B2
  Bottom 2.54: ESC5_CON2.C 27.85,62.08
  pour Bottom: 27.75,65.07 30.45,60.4 22.01,55.52 19.31,60.19
B3
  Bottom 2.54: ESC5_CON3.C 56.97,11.35
  pour Bottom: 51.22,4.93 48.62,9.43 57.06,14.3 59.66,9.8
B4
  Top 2.54: ESC5_CON4.C 47.68,26.11 U$2.P4-10
  pour Top: 42.97,19.22 40.37,23.72 48.81,28.59 51.41,24.09
B5
  Top 2.54: ESC5_CON5.C 101.3,102.89
  pour Top: 97.7,110.4 102.85,110.4 102.85,100.7 97.7,100.7
B6
  Bottom 2.54: ESC5_CON6.C 83.85,102.46
  pour Bottom: 81.1,110.4 86.35,110.4 86.35,100.7 81.1,100.7
B7
  Bottom 2.54: ESC5_CON7.C 25.5,102.5
  pour Bottom: 22.5,110.4 27.7,110.4 27.7,100.7 22.5,100.7
B8
  Top 2.54: ESC5_CON8.C 42.95,103.61 43.1,103.75 U$3.P4-10
  pour Top: 39.05,110.4 44.2,110.4 44.2,100.7 39.05,100.7
B9
  Top 2.54: ESC5_CON9.C 82.5,18
  pour Top: 79.57,17.84 82.17,22.34 90.59,17.48 88,12.98
B10
  Bottom 2.54: ESC5_CON10.C 91.5,33.5
  pour Bottom: 87.82,32.13 90.56,36.86 98.98,32 96.25,27.27
B11
  Bottom 2.54: ESC5_CON11.C 120,83.5
  pour Bottom: 128.19,82.54 125.59,78.04 117.15,82.91 119.75,87.41
B12
  Top 2.54: ESC5_CON12.C 111.5,68.5
  pour Top: 119.94,68.24 117.34,63.75 108.9,68.62 111.5,73.12
CAN_H  (via drill 0.85)
  Top 0.254: U$3.24 61.87,110.75 66.15,110.75 U$10.2 65.02,115.19 54.56,115.22 | U$2.24 U$12.2 25.08,40.35 | 25.08,40.35 1.4,81.41 20.95,115.32 54.56,115.22 | 25.08,40.35 47.62,1.27 86.87,1.27 112.01,44.7 U$4.24 | v54.59,113.67 54.59,115.19 54.56,115.22
CAN_L  (via drill 0.85)
  Top 0.254: U$3.23 63.41,109.75 67.15,109.75 U$10.3 | U$12.3 U$2.23
  Bottom 0.254: U$10.3 73.03,115.32 80.64,115.32 | 80.64,115.32 113.54,115.32 133.22,81.41 114.94,49.91 109.98,47.62 | 109.98,47.62 U$4.23 | 109.98,47.62 84.07,2.03 83.82,1.65 47.88,1.65 25.02,41.53 U$12.3 | v80.59,113.51 80.59,115.27 80.64,115.32
R1
  Top 2.54: ESC5_CON1.A 12.44,85.12
  pour Top: 13.96,88.95 16.6,84.38 8.17,79.52 5.54,84.08
R2
  Bottom 2.54: ESC5_CON2.A 21.54,70.31
  pour Bottom: 22.26,74.58 24.85,70.09 16.42,65.23 13.84,69.71
R3
  Bottom 2.54: ESC5_CON3.A 51.44,19.91
  pour Bottom: 45.72,14.46 43.12,18.96 51.54,23.82 54.14,19.32
R4
  Top 2.54: ESC5_CON4.A 42.8,34.97
  pour Top: 37.47,28.75 34.74,33.48 43.16,38.34 45.89,33.61
R5
  Top 2.54: ESC5_CON5.A 111.5,103
  pour Top: 108.7,110.4 114.05,110.4 114.05,100.7 108.7,100.7
R6
  Bottom 2.54: ESC5_CON6.A 94.06,102.82
  pour Bottom: 92.2,110.4 97.35,110.4 97.35,100.7 92.2,100.7
R7
  Bottom 2.54: ESC5_CON7.A 35.59,102.75
  pour Bottom: 33.55,110.4 38.7,110.4 38.7,100.7 33.55,100.7
R8
  Top 2.54: ESC5_CON8.A 53.1,102.75
  pour Top: 50.05,110.4 55.4,110.4 55.4,100.7 50.05,100.7
R9
  Top 2.54: ESC5_CON9.A 77,9.43
  pour Top: 74.07,8.31 76.67,12.81 85.11,7.94 82.51,3.44
R10
  Bottom 2.54: ESC5_CON10.A 85.91,24.67
  pour Bottom: 82.32,22.61 84.92,27.1 93.36,22.23 90.76,17.73
R11
  Bottom 2.54: ESC5_CON11.A 114.22,75.31
  pour Bottom: 122.69,73.01 120.09,68.51 111.63,73.39 114.23,77.89
R12
  Top 2.54: ESC5_CON12.A 105.69,59.56 U$4.P3-2
  pour Top: 114.44,58.72 111.71,53.99 103.25,58.87 105.98,63.6
Y1
  Bottom 2.54: ESC5_CON1.B 15.26,80.92
  pour Bottom: 16.75,84.12 19.35,79.62 10.91,74.75 8.31,79.25
Y2
  Top 2.54: ESC5_CON2.B 24.91,66.25
  pour Top: 25,69.83 27.6,65.33 19.16,60.46 16.56,64.96
Y3
  Top 2.54: ESC5_CON3.B 54.14,15.77
  pour Top: 48.46,9.71 45.87,14.19 54.31,19.07 56.9,14.58
Y4
  Bottom 2.54: ESC5_CON4.B 45.35,30.62
  pour Bottom: 40.21,24 37.62,28.48 46.05,33.35 48.64,28.87
Y5
  Bottom 2.54: ESC5_CON5.B 106.45,102.73
  pour Bottom: 103.2,110.4 108.35,110.4 108.35,100.7 103.2,100.7
Y6
  Top 2.54: ESC5_CON6.B 89,102.5
  pour Top: 86.7,110.4 91.85,110.4 91.85,100.7 86.7,100.7
Y7
  Top 2.54: ESC5_CON7.B 30.62,102.91
  pour Top: 28.05,110.4 33.2,110.4 33.2,100.7 28.05,100.7
Y8
  Bottom 2.54: ESC5_CON8.B 48.03,102.21 | 48.03,102.21 48.01,102.23 | U$3.P4-1 48.19,102.21 48.03,102.21
  pour Bottom: 44.55,110.4 49.7,110.4 49.7,100.7 44.55,100.7
Y9
  Bottom 2.54: ESC5_CON9.B 79.4,13.93
  pour Bottom: 76.83,13.1 79.42,17.58 87.86,12.71 85.27,8.22
Y10
  Top 2.54: ESC5_CON10.B 88.8,28.93
  pour Top: 85.08,27.38 87.67,31.87 96.11,27 93.52,22.52
Y11
  Top 2.54: ESC5_CON11.B 117.26,79.4
  pour Top: 125.43,77.76 122.84,73.27 114.4,78.15 116.99,82.63
Y12
  Bottom 2.54: ESC5_CON12.B 108.81,63.93
  pour Bottom: 117.18,63.47 114.59,58.98 106.12,63.88 108.71,68.36

### Text on the board
tNames: CAN | 5/64" Hex | +5V | +5V_GND | 3/32" Hex | +12V | +5V | +12V_GND | 5/64" Hex | +5V | +5V_GND | +12V | +12V | CAN | +12V_GND | BACKPLANE V1 1/7/2019 / / Designed By: / Jacob Bobson / Jason King / Tyler Stagge | +12V